# Altium schematic sheet [01]_Controllers Sheet.SchDoc
size OrCAD A; DocumentNumber: 1; SheetNumber: 1; SheetTotal: 5
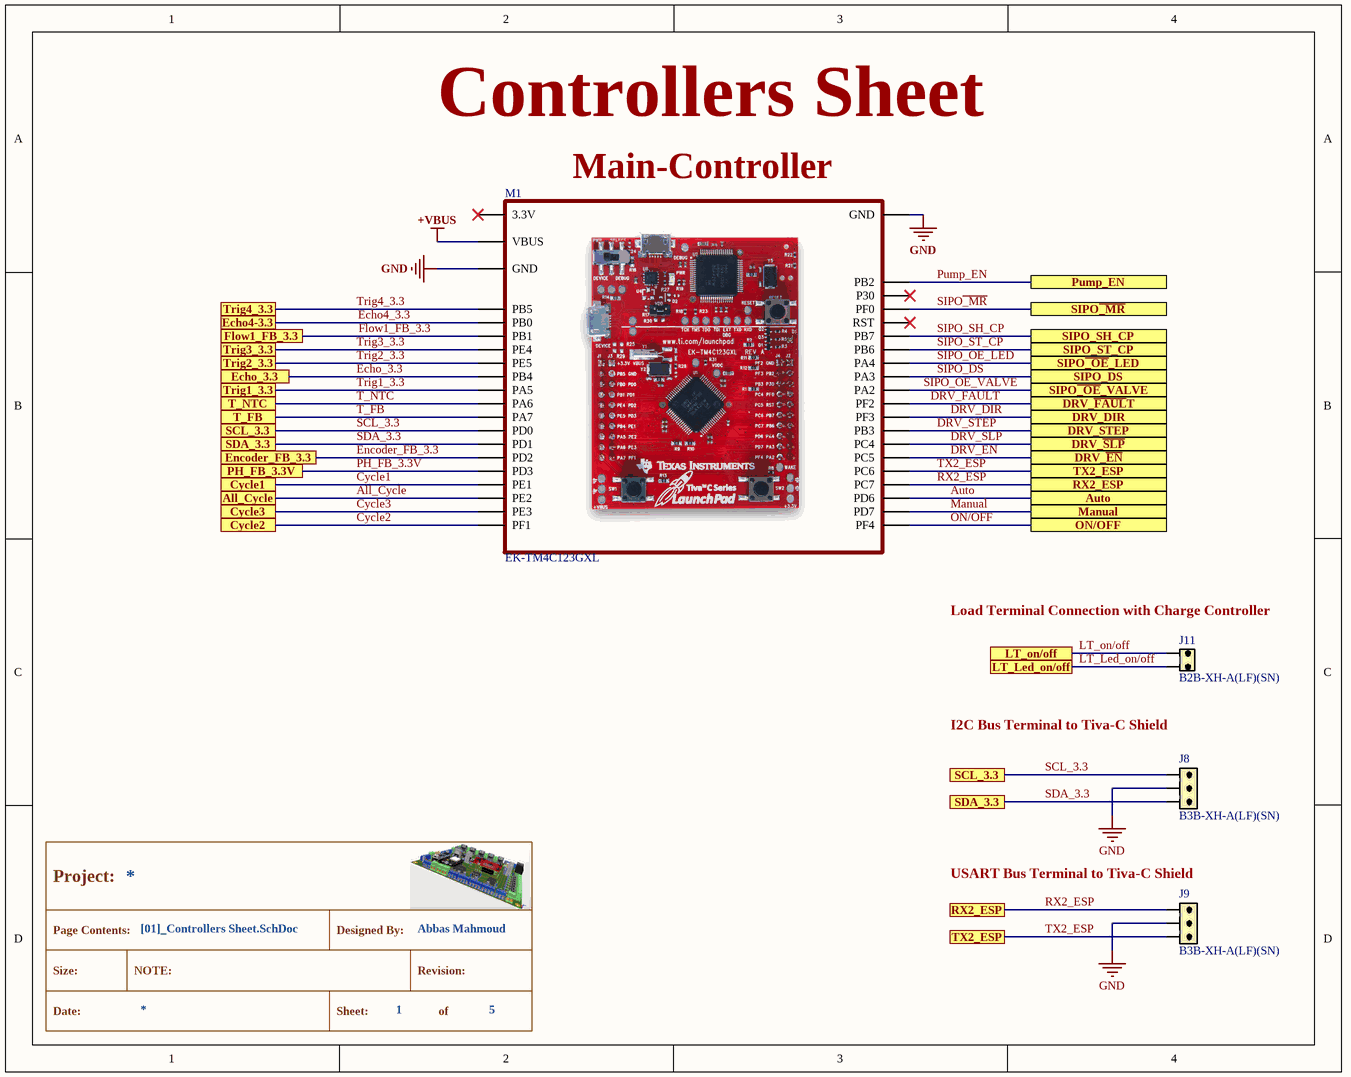
[diagram p0: [01]_Controllers Sheet.SchDoc]

## Parts
*  Title Block  (value not drawn)  (graphical)
J8  B3B-XH-A(LF)(SN)  [XH - 3P - Vertical - Package - THT - P = 2.54]
J9  B3B-XH-A(LF)(SN)  [XH - 3P - Vertical - Package - THT - P = 2.54]
J11  B2B-XH-A(LF)(SN)  [XH - 2P - Vertical - Package - THT - P = 2.54]
M1  EK-TM4C123GXL  [Tiva-C]

## Ports
All_Cycle, Auto, Cycle1, Cycle2, Cycle3, DRV_DIR, DRV_STEP, DRV_~{EN}, DRV_~{FAUL}T, DRV_~{SLP}, Echo4-3.3, Echo_3.3, Encoder_FB_3.3, Flow1_FB_3.3, LT_Led_on/off, LT_on/off, Manual, ON/OFF, PH_FB_3.3V, Pump_EN, RX2_ESP, SCL_3.3, SDA_3.3, SIPO_DS, SIPO_SH_CP, SIPO_ST_CP, SIPO~{_MR}, SIPO~{_OE}_LED, SIPO~{_OE}_VALVE, T_FB, T_NTC, Trig1_3.3, Trig2_3.3, Trig3_3.3, Trig4_3.3, TX2_ESP

## Nets
+VBUS: M1.VBUS
GND: J8.2 J9.2 M1.GND
All_Cycle: M1.PE2 ; port All_Cycle
Auto: M1.PD6 ; port Auto
Cycle1: M1.PE1 ; port Cycle1
Cycle2: M1.PF1 ; port Cycle2
Cycle3: M1.PE3 ; port Cycle3
DRV_DIR: M1.PF3 ; port DRV_DIR
DRV_~{EN}: M1.PC5 ; port DRV_~{EN}
DRV_~{FAULT}: M1.PF2 ; port DRV_~{FAUL}T
DRV_~{SLP}: M1.PC4 ; port DRV_~{SLP}
DRV_STEP: M1.PB3 ; port DRV_STEP
Echo4_3.3: M1.PB0 ; port Echo4-3.3
Echo_3.3: M1.PB4 ; port Echo_3.3
Encoder_FB_3.3: M1.PD2 ; port Encoder_FB_3.3
Flow1_FB_3.3: M1.PB1 ; port Flow1_FB_3.3
LT_Led_on/off: J11.2 ; port LT_Led_on/off
LT_on/off: J11.1 ; port LT_on/off
Manual: M1.PD7 ; port Manual
ON/OFF: M1.PF4 ; port ON/OFF
PH_FB_3.3V: M1.PD3 ; port PH_FB_3.3V
Pump_EN: M1.PB2 ; port Pump_EN
RX2_ESP: J9.1 M1.PC7 ; port RX2_ESP
SCL_3.3: J8.1 M1.PD0 ; port SCL_3.3
SDA_3.3: J8.3 M1.PD1 ; port SDA_3.3
SIPO~{_MR}: M1.PF0 ; port SIPO~{_MR}
SIPO~{_OE}_LED: M1.PA4 ; port SIPO~{_OE}_LED
SIPO~{_OE}_VALVE: M1.PA2 ; port SIPO~{_OE}_VALVE
SIPO_DS: M1.PA3 ; port SIPO_DS
SIPO_SH_CP: M1.PB7 ; port SIPO_SH_CP
SIPO_ST_CP: M1.PB6 ; port SIPO_ST_CP
T_FB: M1.PA7 ; port T_FB
T_NTC: M1.PA6 ; port T_NTC
Trig1_3.3: M1.PA5 ; port Trig1_3.3
Trig2_3.3: M1.PE5 ; port Trig2_3.3
Trig3_3.3: M1.PE4 ; port Trig3_3.3
Trig4_3.3: M1.PB5 ; port Trig4_3.3
TX2_ESP: J9.3 M1.PC6 ; port TX2_ESP

Not connected (* = marked no-connect by the designer): M1 3.3V* P30* RST*

## Notes on the sheet
- Controllers Sheet
- (near M1) Main-Controller
- (near J11) Load Terminal Connection with Charge Controller
- I2C Bus Terminal to Tiva-C Shield
- (near J9) USART Bus Terminal to Tiva-C Shield
- (in symbol Title Block) Project:; Page Contents:; Designed By:; Abbas Mahmoud; Size:; NOTE:; Revision:; Date:; Sheet:; of

## Library data of the parts
* = Title Block: Moatley Title Block
J8 J9 = XH - Male Header - 3P - THT - Vertical: XH Header Male Pin 0.098"(2.50mm) 3 Pins Through Hole,P=2.5mm Wire To Board / Wire To Wire Connector RoHS; Manufacturer: JST Sales America; Mfr.Part #: B3B-XH-A(LF)(SN); Package: Through Hole,P=2.5mm
J11 = XH - Male Header - 2P - THT - Vertical: XH Header Male Pin 0.098" (2.50mm) 2 Pins Through Hole,P=2.5mm Wire To Board / Wire To Wire Connector RoHS; Manufacturer: JST Sales America; Mfr.Part #: B2B-XH-A(LF)(SN); Package: Through Hole,P=2.5mm
M1 = Tiva-C: EK-TM4C123GXL: Tiva C Microcontroller LaunchPad Evaluation KitEK-TM4C123GXL: Tiva C Microcontroller LaunchPad Evaluation Kit